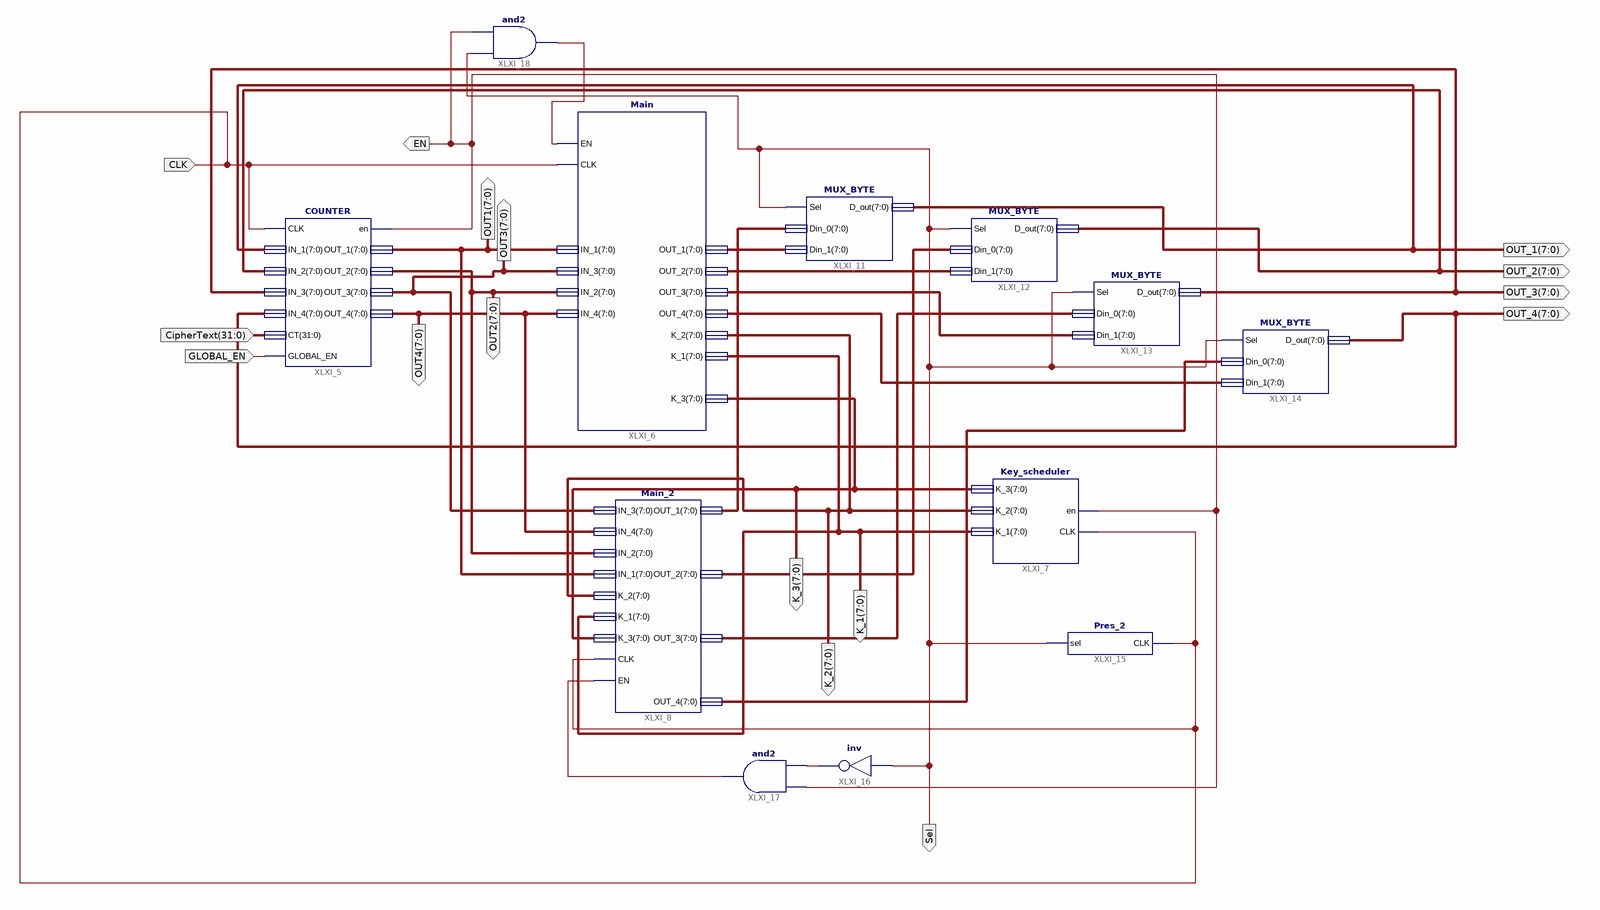
[diagram p0: schematic sheet 1]
// Xilinx ISE schematic Rough_S_LUT.sch (virtex5) as structural Verilog: 12 symbols, 16 ports
module Rough_S_LUT (
  input  CLK,
  input  [31:0] CipherText,
  input  GLOBAL_EN,
  output [7:0] OUT1,
  output [7:0] OUT2,
  output [7:0] OUT3,
  output [7:0] OUT4,
  output [7:0] OUT_1,
  output [7:0] OUT_2,
  output [7:0] OUT_4,
  output EN,
  output [7:0] K_3,
  output [7:0] K_1,
  output [7:0] K_2,
  output [7:0] OUT_3,
  output Sel
);

  wire XLXN_38, XLXN_43, XLXN_46;
  wire [7:0] XLXN_8, XLXN_9, XLXN_10, XLXN_11, XLXN_31, XLXN_32, XLXN_33, XLXN_34;

  Main XLXI_6 (
    .IN_1(OUT1), .EN(XLXN_46), .CLK(CLK), .IN_3(OUT3), .IN_2(OUT2), .IN_4(OUT4), .K_3(K_3), .K_2(K_2),
    .K_1(K_1), .OUT_1(XLXN_11), .OUT_2(XLXN_10), .OUT_3(XLXN_9), .OUT_4(XLXN_8));
  COUNTER XLXI_5 (
    .CLK(CLK), .GLOBAL_EN(GLOBAL_EN), .IN_1(OUT_1), .IN_2(OUT_2), .IN_3(OUT_3), .IN_4(OUT_4),
    .CT(CipherText), .en(EN), .OUT_1(OUT1), .OUT_2(OUT2), .OUT_3(OUT3), .OUT_4(OUT4));
  Key_scheduler XLXI_7 (.CLK(CLK), .en(EN), .K_1(K_1), .K_2(K_2), .K_3(K_3));
  Main_2 XLXI_8 (
    .IN_3(OUT3), .IN_4(OUT4), .IN_2(OUT2), .IN_1(OUT1), .K_2(K_2), .K_1(K_1), .K_3(K_3), .CLK(CLK),
    .EN(XLXN_38), .OUT_1(XLXN_31), .OUT_2(XLXN_32), .OUT_3(XLXN_33), .OUT_4(XLXN_34));
  MUX_BYTE XLXI_11 (.Sel(Sel), .Din_0(XLXN_31), .Din_1(XLXN_11), .D_out(OUT_1));
  MUX_BYTE XLXI_12 (.Sel(Sel), .Din_0(XLXN_32), .Din_1(XLXN_10), .D_out(OUT_2));
  MUX_BYTE XLXI_13 (.Sel(Sel), .Din_0(XLXN_33), .Din_1(XLXN_9), .D_out(OUT_3));
  MUX_BYTE XLXI_14 (.Sel(Sel), .Din_0(XLXN_34), .Din_1(XLXN_8), .D_out(OUT_4));
  Pres_2 XLXI_15 (.CLK(CLK), .sel(Sel));
  not XLXI_16 (XLXN_43, Sel);
  and XLXI_17 (XLXN_38, XLXN_43, EN);
  and XLXI_18 (XLXN_46, EN, Sel);
endmodule
